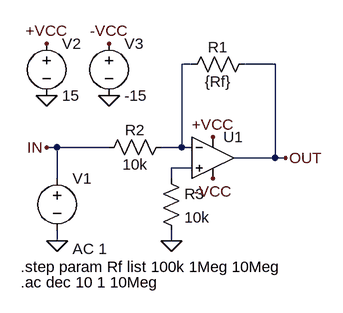
[diagram p0: schematic zad3_lista5.asc]
zad3_lista5.asc, the LTspice schematic file:
Version 4.1
SHEET 1 880 680
WIRE 224 0 208 0
WIRE 352 0 304 0
WIRE 16 128 0 128
WIRE 96 128 16 128
WIRE 208 128 208 0
WIRE 208 128 176 128
WIRE 224 128 208 128
WIRE 352 144 352 0
WIRE 352 144 288 144
WIRE 368 144 352 144
WIRE 224 160 192 160
WIRE 16 176 16 128
WIRE 192 176 192 160
WIRE 16 272 16 256
WIRE 192 272 192 256
FLAG 192 272 0
FLAG 16 272 0
FLAG 368 144 OUT
FLAG 0 128 IN
FLAG 96 48 0
FLAG 0 48 0
FLAG 256 112 +VCC
FLAG 256 176 -VCC
FLAG 0 -32 +VCC
FLAG 96 -32 -VCC
SYMBOL res 320 -16 R90
WINDOW 0 5 56 VBottom 2
WINDOW 3 27 56 VTop 2
SYMATTR InstName R1
SYMATTR Value {Rf}
SYMBOL res 192 112 R90
WINDOW 0 5 56 VBottom 2
WINDOW 3 27 56 VTop 2
SYMATTR InstName R2
SYMATTR Value 10k
SYMBOL voltage 16 160 R0
WINDOW 123 24 124 Left 2
WINDOW 39 0 0 Left 0
SYMATTR InstName V1
SYMATTR Value ""
SYMATTR Value2 AC 1
SYMBOL res 176 160 R0
SYMATTR InstName R3
SYMATTR Value 10k
SYMBOL voltage 0 -48 R0
WINDOW 123 0 0 Left 0
WINDOW 39 0 0 Left 0
SYMATTR InstName V2
SYMATTR Value 15
SYMBOL voltage 96 -48 R0
WINDOW 123 0 0 Left 0
WINDOW 39 0 0 Left 0
SYMATTR InstName V3
SYMATTR Value -15
SYMBOL OpAmps\\UniversalOpAmp2 256 144 R0
SYMATTR InstName U1
TEXT -40 312 Left 2 !.step param Rf list 100k 1Meg 10Meg
TEXT -40 336 Left 2 !.ac dec 10 1 10Meg

The netlist it stands for:
* zad3_lista5.asc
R1 OUT N001 {Rf}
R2 N001 IN 10k
V1 IN 0 AC 1
R3 N002 0 10k
V2 +VCC 0 15
V3 -VCC 0 -15
X§U1 N002 N001 +VCC -VCC OUT level2 Avol=1Meg GBW=10Meg Slew=10Meg Ilimit=25m Rail=0 Vos=0 En=0 Enk=0 In=0 Ink=0 Rin=500Meg  ; pins In+ In- V+ V- OUT
.step param Rf list 100k 1Meg 10Meg
.ac dec 10 1 10Meg
.lib UniversalOpAmp2.lib
.backanno
.end